# EAGLE schematic mechanical-endstop-shapeoko (EAGLE 6.2)
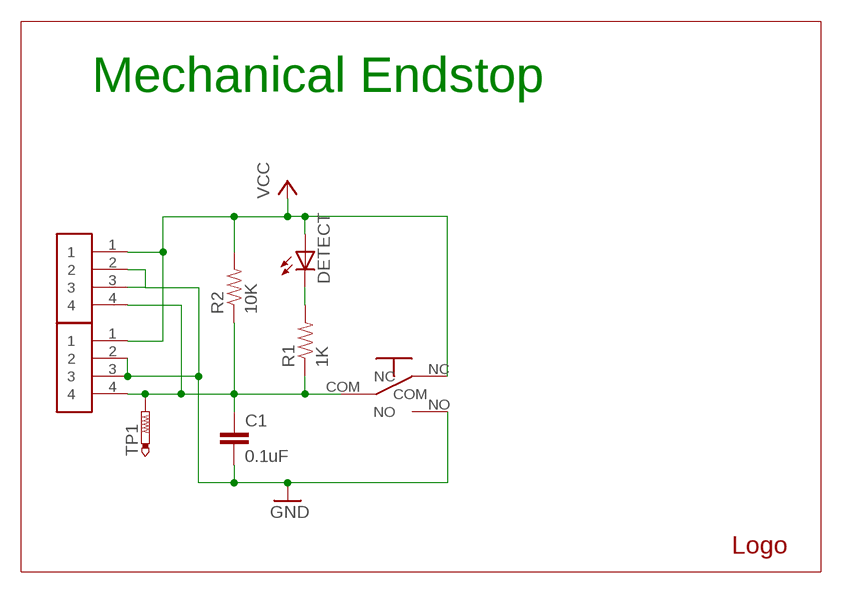
[diagram p0: schematic, sheet 1]

## Parts
C1  0.1uF  CAP-0805  [0805-CAP]
DETECT  LED0603  [LED-0603]
R1  1K  RESISTOR-0805  [R0805]
R2  10K  RESISTOR-0805  [R0805]
TP1  PTR1TP09R  [TP09R]
U$1  CDROM-HOR  [70553-04]
U$2  OMRON-D2FA  [OMRON-D2F-A]
U$4  OSHW-LOGO-OUTLINE  [OSHW-LOGO-OUTLINE]
U$5  CDROM-HOR  [70553-04]

## Nets
GND: C1.2 U$1.2 U$1.3 U$2.NO U$5.2 U$5.3
N$1: DETECT.C R1.2
N$2: C1.1 R1.1 R2.1 TP1.TP U$1.4 U$2.COM U$5.4
VCC: DETECT.A R2.2 U$1.1 U$2.NC U$5.1

## Notes on the sheet
- Mechanical Endstop

## Library data of the parts
C1 = akafugu:CAP: Capacitor Standard 0603 ceramic capacitor, and 0.1" leaded capacitor.
DETECT = akafugu:LED: LEDs Standard schematic elements and footprints for 5mm, 3mm, 1206, and 0603 sized LEDs. 5mm - Spark Fun Electronics SKU : COM-00529 (and others)
R1 R2 = akafugu:RESISTOR: Resistor Basic schematic elements and footprints for 0603, 1206, and PTH resistors.
TP1 = testpad:PTR1: TEST PIN
U$1 U$5 = akafugu:CDROM
U$2 = reprap:OMRON-D2F
U$4 = akafugu:OSHW-LOGO

## Net classes
0 default: width 0.813 mm, drill 0.635 mm, clearance 0.635 mm